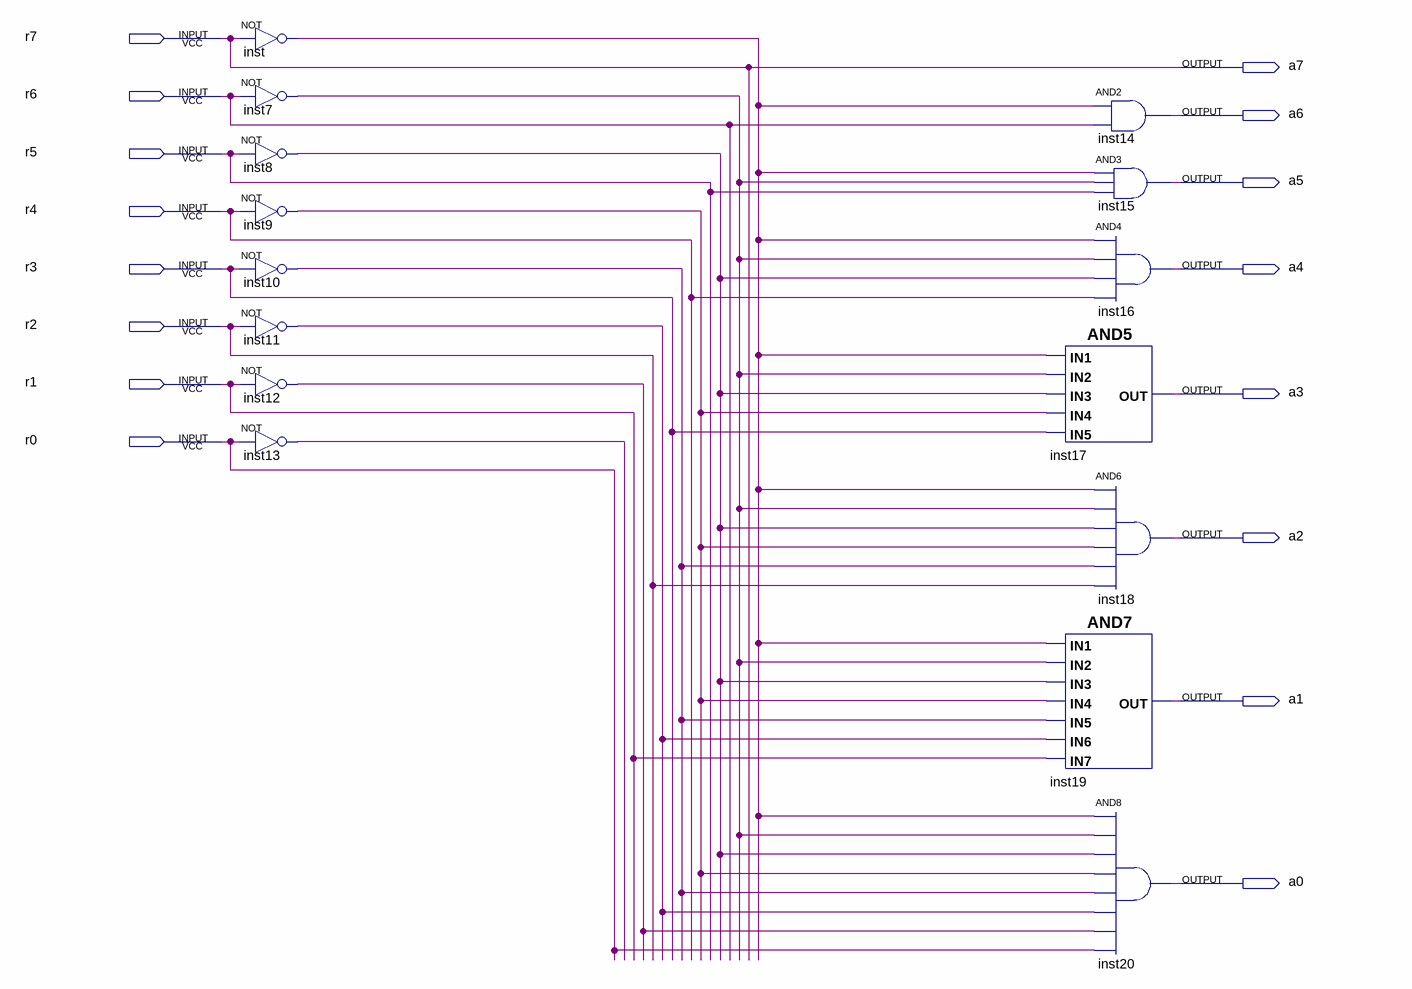
[diagram p0: schematic sheet]
// Quartus schematic hpi_8in_8out.bdf as structural Verilog: 15 symbols, 16 pins
module hpi_8in_8out (
  input  r7,
  input  r6,
  input  r5,
  input  r4,
  input  r3,
  input  r2,
  input  r1,
  input  r0,
  output a7,
  output a6,
  output a5,
  output a4,
  output a3,
  output a2,
  output a1,
  output a0
);

  wire inst7_out, inst8_out, inst9_out, inst10_out, inst11_out, inst12_out, inst13_out, inst_out;

  not inst (inst_out, r7);
  not inst7 (inst7_out, r6);
  not inst8 (inst8_out, r5);
  not inst9 (inst9_out, r4);
  not inst10 (inst10_out, r3);
  not inst11 (inst11_out, r2);
  not inst12 (inst12_out, r1);
  not inst13 (inst13_out, r0);
  and inst14 (a6, inst_out, r6);
  and inst15 (a5, inst_out, inst7_out, r5);
  and inst16 (a4, inst_out, inst7_out, inst8_out, r4);
  and inst17 (a3, inst_out, inst7_out, inst8_out, inst9_out, r3);
  and inst18 (a2, inst_out, inst7_out, inst8_out, inst9_out, inst10_out, r2);
  and inst19 (a1, inst_out, inst7_out, inst8_out, inst9_out, inst10_out, inst11_out, r1);
  and inst20 (a0, inst_out, inst7_out, inst8_out, inst9_out, inst10_out, inst11_out, inst12_out, r0);

  assign a7 = r7;
endmodule
